# EAGLE design template (EAGLE 7.3.0)
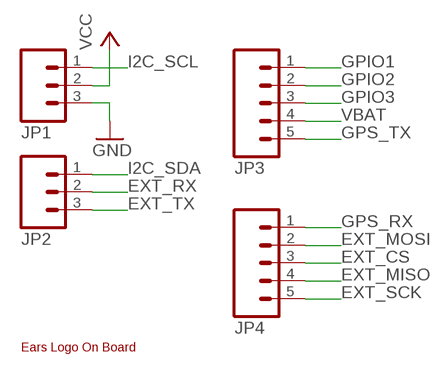
[diagram p0: schematic, sheet 1]

## Parts
JP1  M03PTH  [1X03]
JP2  M03PTH  [1X03]
JP3  M05PTH  [1X05]
JP4  M05PTH  [1X05]
U$10  EARS-LOGO  [EARS-LOGO]

## Nets
EXT_CS: JP4.3
EXT_MISO: JP4.4
EXT_MOSI: JP4.2
EXT_RX: JP2.2
EXT_SCK: JP4.5
EXT_TX: JP2.3
GND: JP1.3
GPIO1: JP3.1
GPIO2: JP3.2
GPIO3: JP3.3
GPS_RX: JP4.1
GPS_TX: JP3.5
I2C_SCL: JP1.1
I2C_SDA: JP2.1
VBAT: JP3.4
VCC: JP1.2

## Library data of the parts
JP1 JP2 = SparkFun:M03: Header 3 Standard 3-pin 0.1" header. Use with straight break away headers (SKU : PRT-00116), right angle break away headers (PRT-00553), swiss pins (PRT-00743), machine pins (PRT-00117), and female headers (PRT-00115). Molex polarized connector foot print use with SKU : PRT-08232 with associated crimp pins and housings.
JP3 JP4 = SparkFun:M05: Header 5 Standard 5-pin 0.1" header. Use with straight break away headers (SKU : PRT-00116), right angle break away headers (PRT-00553), swiss pins (PRT-00743), machine pins (PRT-00117), and female headers (PRT-00115). Molex polarized connector foot print use with SKU : PRT-08230 with associated crimp pins and housings.
U$10 = earsLogo:EARS-LOGO

## Board
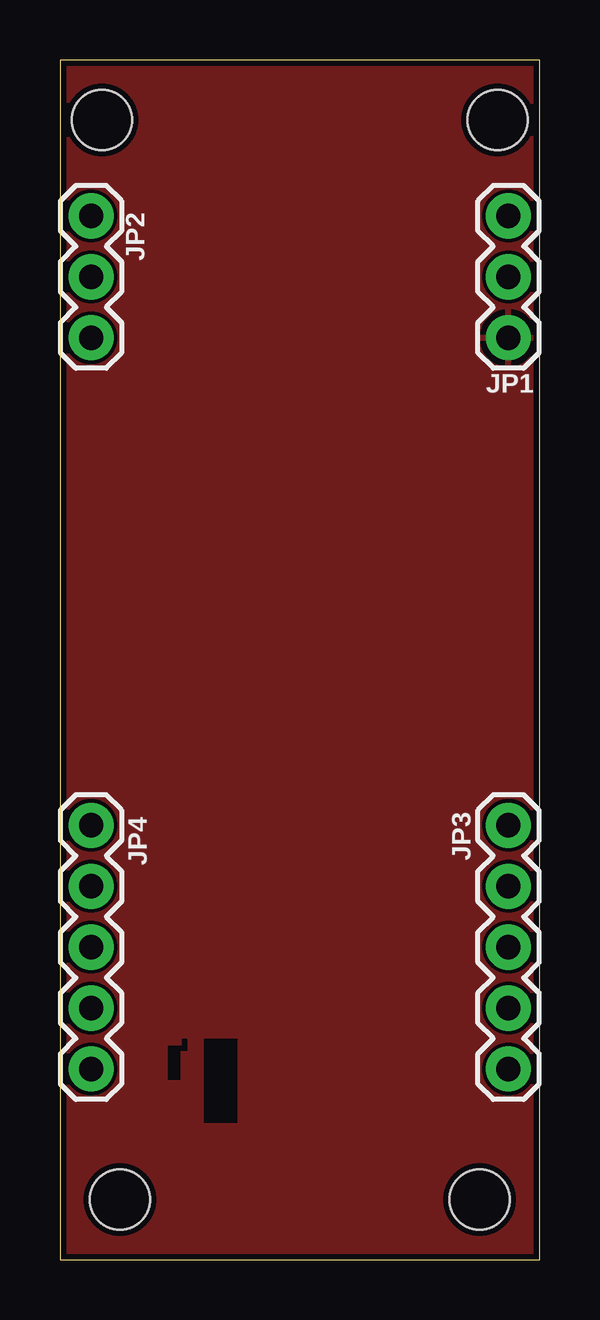
[diagram p1: board, top side]
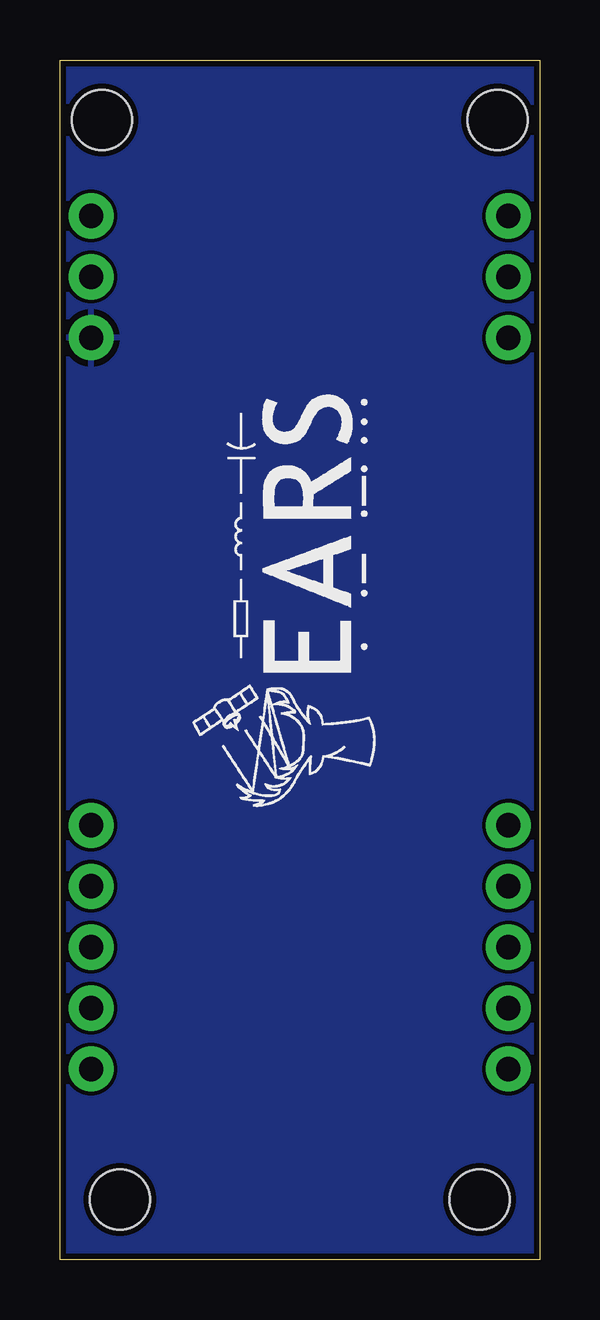
[diagram p2: board, bottom side, seen from below]

Size 20 x 50 mm. Coordinates in mm from the lower left corner, seen from the top.
Outline: 0,0 20,0 20,50 0,50 0,0
Copper layers (1*16): Top 0.035mm / dielectric 1.5mm / Bottom 0.035mm
Design rules "SeeedStudio_2layer_DRU_no_angle_20140221": minimum track width 6mil, minimum drill 12mil, track to track 6mil, track to pad 6mil, pad to pad 6mil, via to via 6mil, smd to smd 0mil, copper to edge 10mil, drill to drill 10mil, minimum pad ring 10mil, minimum via ring 6mil, stop-mask expansion 2mil, vias tented up to drill 100mil, thermal gap 10mil
Holes 2.5 mm at 1.75,47.5 18.25,47.5 2.5,2.5 17.5,2.5
tKeepout: area 0,45 to 3.5,50; area 0,0 to 5,5; area 15,0 to 20,5
bKeepout: area 0,45 to 3.5,50; area 16.5,45 to 20,50; area 0,0 to 5,5; area 15,0 to 20,5
tRestrict: area 6,5.7 to 7.4,9.2; area 4.5,7.5 to 5.3,9.2

### Footprints (pad centres in the part's own frame; a part is rotated, then mirrored left to right if it is on the bottom)
1X03 = drill 1.016 pad 1.88: 1 0,0; 2 2.54,0; 3 5.08,0
1X05 = drill 1.016 pad 1.88: 1 0,0; 2 2.54,0; 3 5.08,0; 4 7.62,0; 5 10.16,0

### Placement (x,y rotation side)
JP1  18.7,43.5 270 top
JP2  1.3,43.5 270 top
JP3  18.7,18.1 270 top
JP4  1.3,18.1 270 top
U$10  9.7,28.3 90 bottom

### Tracks (layer width: path | path; a pad name or v marks a point on that pad's centre or on a via)
GND
  pour Bottom: 0,50 0,-0.1 20,-0.1 20,50
  pour Top: 20,-0.1 0,-0.1 0,50 20,50